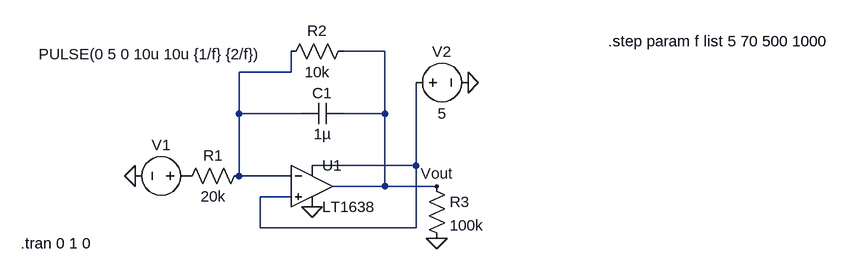
[diagram p0: schematic active LPF.asc]
active LPF.asc, the LTspice schematic file:
Version 4
SHEET 1 1172 680
WIRE 368 -48 304 -48
WIRE 224 -16 224 -48
WIRE 224 -16 144 -16
WIRE 144 48 144 -16
WIRE 240 48 144 48
WIRE 368 48 368 -48
WIRE 368 48 304 48
WIRE 416 128 416 0
WIRE 416 128 256 128
WIRE 144 144 144 48
WIRE 224 144 144 144
WIRE 368 160 368 48
WIRE 368 160 288 160
WIRE 448 160 368 160
WIRE 224 176 176 176
WIRE 176 224 176 176
WIRE 416 224 416 128
WIRE 416 224 176 224
FLAG -16 144 0
FLAG 256 192 0
FLAG 496 0 0
FLAG 448 160 Vout
FLAG 448 240 0
SYMBOL res 160 128 R90
WINDOW 0 0 56 VBottom 2
WINDOW 3 32 56 VTop 2
SYMATTR InstName R1
SYMATTR Value 20k
SYMBOL cap 304 32 R90
WINDOW 0 0 32 VBottom 2
WINDOW 3 32 32 VTop 2
SYMATTR InstName C1
SYMATTR Value 1µ
SYMBOL OpAmps\\LT1638 256 96 R0
SYMATTR InstName U1
SYMBOL voltage 80 144 R90
WINDOW 0 -32 56 VBottom 2
WINDOW 3 -203 73 VTop 2
WINDOW 123 0 0 Left 0
WINDOW 39 0 0 Left 0
SYMATTR InstName V1
SYMATTR Value PULSE(0 5 0 10u 10u {1/f} {2/f})
SYMBOL voltage 400 0 R270
WINDOW 0 32 56 VTop 2
WINDOW 3 -32 56 VBottom 2
SYMATTR InstName V2
SYMATTR Value 5
SYMBOL res 320 -64 R90
WINDOW 0 0 56 VBottom 2
WINDOW 3 32 56 VTop 2
SYMATTR InstName R2
SYMATTR Value 10k
SYMBOL res 432 144 R0
SYMATTR InstName R3
SYMATTR Value 100k
TEXT -192 248 Left 2 !.tran 0 1 0
TEXT 712 -64 Left 2 !.step param f list 5 70 500 1000

The netlist it stands for:
* active LPF.asc
R1 N001 P001 20k
C1 Vout N001 1µ
XU1 N002 N001 N002 0 Vout LT1638  ; pins In+ In- V+ V- OUT
V1 P001 0 PULSE(0 5 0 10u 10u {1/f} {2/f})
V2 N002 0 5
R2 Vout N001 10k
R3 Vout 0 100k
.tran 0 1 0
.step param f list 5 70 500 1000
.backanno
.end